# Altium schematic sheet Sheet1.SchDoc (part 2 of 3)
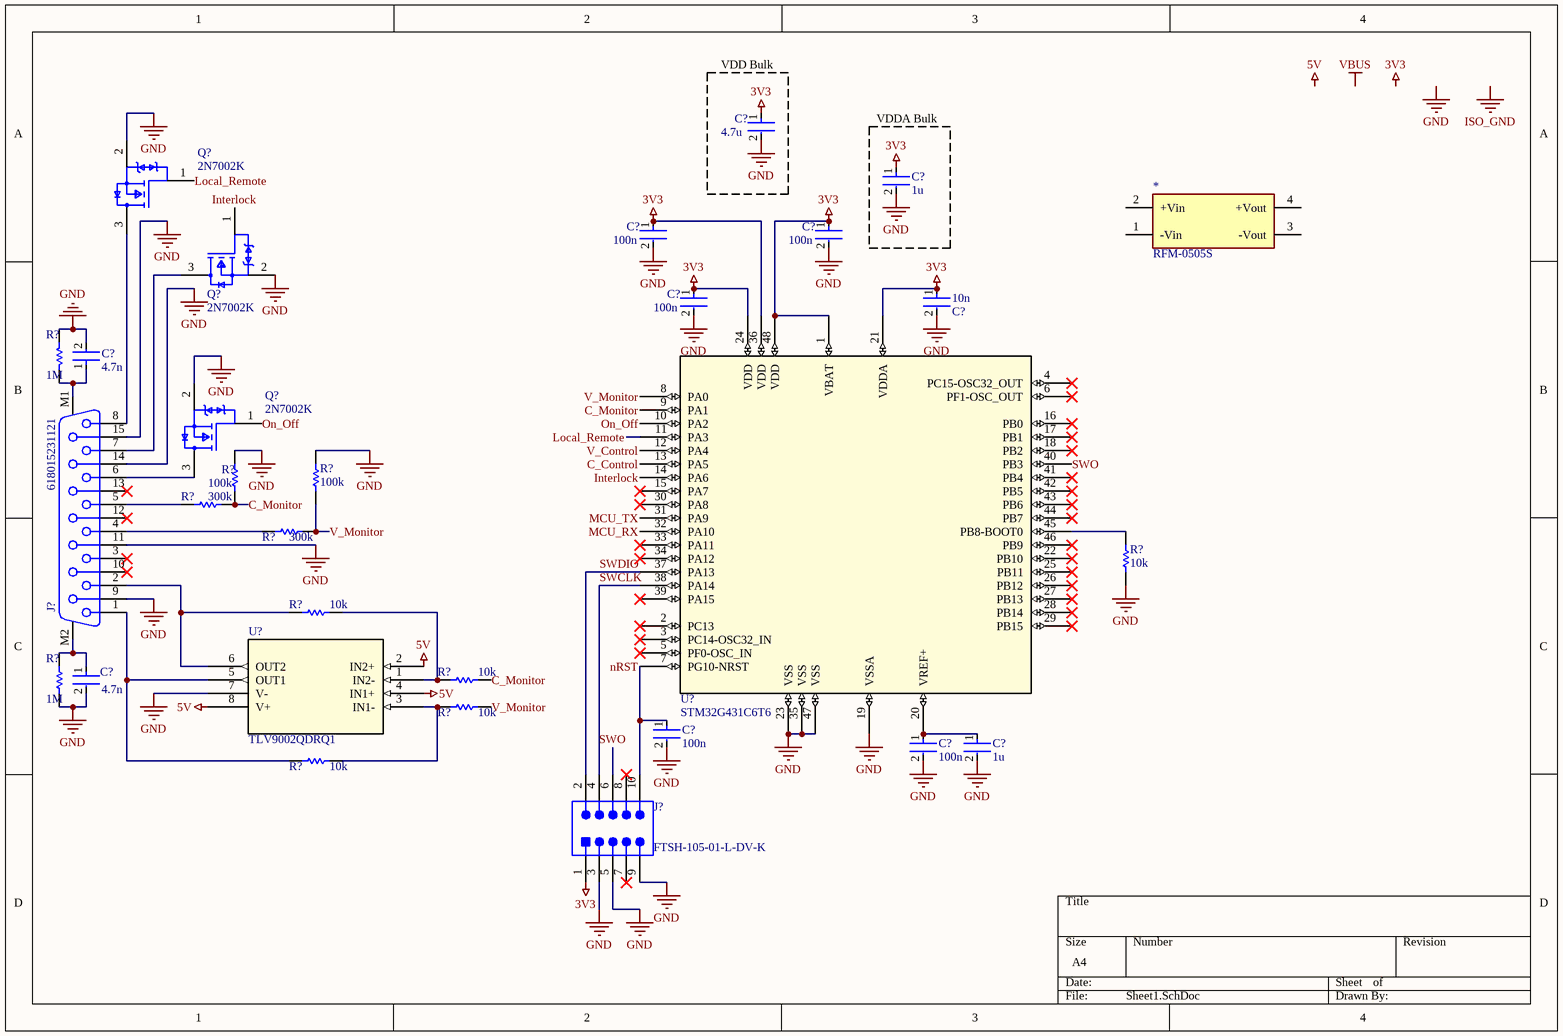
[diagram p1: Sheet1.SchDoc]
## Library data of the parts
10n = CC0603MRX7R9BB103: 50V 10nF X7R ±20% 0603 Multilayer Ceramic Capacitors MLCC - SMD/SMT ROHS; Manufacturer: Yageo Group; Supplier: DigiKey; Supplier Part Number: 311-1826-1-ND; Manufacturer Part Number: CC0603MRX7R9BB103; RoHS: Compliant; Category: Ceramic Capacitors; Stock: 1798; Pricing: 1=0.1, 10=0.032, 50=0.0214, 100=0.0182, 500=0.01294, 1000=0.01133 (USD); Value: 10nF; Case/Package: 0603; Case Code (Imperial): 0603; Case Code (Metric): 1608; China RoHS: Compliant; Composition: Ceramic; Country of Origin: Mainland China, Taiwan; Depth: 800µm; Dielectric: X7R; Dielectric Material: Ceramic; Export Control Classification Number (ECCN) Code: EAR99; Halogen Free: Halogen Free; Height: 800µm; Harmonized Tariff Schedule (HTS) Code: 8532.24.00.20; Introduction Date: 2009-04-17; Lead Free: Lead Free; Length: 1.6mm; Lifecycle Status: Production; Material: Ceramic; Max Operating Temperature: 125°C; Min Operating Temperature: -55°C; Mounting Technology: Surface Mount; Pins: 2; Number of Terminals: 2; Packaging: Tape and Reel; Radiation Hardening: No; REACH SVHC: Yes; Schedule B: 8532240020, 8532240020|8532240020|8532240020|8532240020|8532240020; Termination: SMD/SMT; Thickness: 889µm; Tolerance: 20%; Voltage Rating: 50V; Voltage Rating (DC): 50V; Weight: 2.012816mg; Width: 800µm; ComponentLink1URL: https://datasheet.octopart.com:443/CC0603MRX7R9BB103-Yageo-datasheet-177165144.pdf?src-supplier=IHS; ComponentLink1Description: https://datasheet.octopart.com:443/CC0603MRX7R9BB103-Yageo-datasheet-177165144.pdf?src-supplier=IHS; ComponentLink2URL: https://datasheet.octopart.com:443/CC0603MRX7R9BB103-Yageo-datasheet-82288757.pdf?src-supplier=Upverter; ComponentLink2Description: https://datasheet.octopart.com:443/CC0603MRX7R9BB103-Yageo-datasheet-82288757.pdf?src-supplier=Upverter; ComponentLink3URL: https://datasheet.octopart.com:443/CC0603MRX7R9BB103-Yageo-datasheet-147453679.pdf?src-supplier=Farnell; ComponentLink3Description: https://datasheet.octopart.com:443/CC0603MRX7R9BB103-Yageo-datasheet-147453679.pdf?src-supplier=Farnell; ComponentLink4URL: https://datasheet.octopart.com:443/CC0603MRX7R9BB103-Yageo-datasheet-182029748.pdf?src-supplier=Farnell; ComponentLink4Description: https://datasheet.octopart.com:443/CC0603MRX7R9BB103-Yageo-datasheet-182029748.pdf?src-supplier=Farnell; ComponentLink5URL: https://datasheet.octopart.com:443/CC0603MRX7R9BB103-Yageo-datasheet-182029747.pdf?src-supplier=Farnell; ComponentLink5Description: https://datasheet.octopart.com:443/CC0603MRX7R9BB103-Yageo-datasheet-182029747.pdf?src-supplier=Farnell; ComponentLink6URL: https://datasheet.octopart.com:443/CC0603MRX7R9BB103-Yageo-datasheet-151948686.pdf?src-supplier=Farnell; ComponentLink6Description: https://datasheet.octopart.com:443/CC0603MRX7R9BB103-Yageo-datasheet-151948686.pdf?src-supplier=Farnell; ComponentLink7URL: https://datasheet.octopart.com:443/CC0603MRX7R9BB103-Yageo-datasheet-62336348.pdf?src-supplier=element14+APAC; ComponentLink7Description: https://datasheet.octopart.com:443/CC0603MRX7R9BB103-Yageo-datasheet-62336348.pdf?src-supplier=element14+APAC; ComponentLink8URL: https://datasheet.octopart.com/CC0603MRX7R9BB103-Yageo-datasheet-10883670.pdf; ComponentLink8Description: https://datasheet.octopart.com/CC0603MRX7R9BB103-Yageo-datasheet-10883670.pdf; ComponentLink9URL: https://datasheet.octopart.com:443/CC0603MRX7R9BB103-Yageo-datasheet-166511530.pdf?src-supplier=Future+Electronics; ComponentLink9Description: https://datasheet.octopart.com:443/CC0603MRX7R9BB103-Yageo-datasheet-166511530.pdf?src-supplier=Future+Electronics; ComponentLink10URL: https://datasheet.octopart.com:443/CC0603MRX7R9BB103-Yageo-datasheet-137700082.pdf?src-supplier=Future+Electronics; ComponentLink10Description: https://datasheet.octopart.com:443/CC0603MRX7R9BB103-Yageo-datasheet-137700082.pdf?src-supplier=Future+Electronics; ComponentLink11URL: https://datasheet.octopart.com:443/CC0603MRX7R9BB103-Yageo-datasheet-27626582.pdf?src-supplier=Future+Electronics; ComponentLink11Description: https://datasheet.octopart.com:443/CC0603MRX7R9BB103-Yageo-datasheet-27626582.pdf?src-supplier=Future+Electronics; ComponentLink12URL: https://datasheet.octopart.com:443/CC0603MRX7R9BB103-Yageo-datasheet-15895757.pdf?src-supplier=Future+Electronics; ComponentLink12Description: https://datasheet.octopart.com:443/CC0603MRX7R9BB103-Yageo-datasheet-15895757.pdf?src-supplier=Future+Electronics; ComponentLink13URL: https://datasheet.octopart.com:443/CC0603MRX7R9BB103-Yageo-datasheet-12526321.pdf?src-supplier=Future+Electronics; ComponentLink13Description: https://datasheet.octopart.com:443/CC0603MRX7R9BB103-Yageo-datasheet-12526321.pdf?src-supplier=Future+Electronics; ComponentLink14URL: https://datasheet.octopart.com:443/CC0603MRX7R9BB103-Yageo-datasheet-10882999.pdf?src-supplier=Future+Electronics; ComponentLink14Description: https://datasheet.octopart.com:443/CC0603MRX7R9BB103-Yageo-datasheet-10882999.pdf?src-supplier=Future+Electronics; ComponentLink15URL: https://datasheet.octopart.com:443/CC0603MRX7R9BB103-Yageo-Group-datasheet-165992755.pdf?src-supplier=ODG+(Origin+Data+Global); ComponentLink15Description: https://datasheet.octopart.com:443/CC0603MRX7R9BB103-Yageo-Group-datasheet-165992755.pdf?src-supplier=ODG+(Origin+Data+Global); ComponentLink16URL: http://sigma.octopart.com:80/conflict_mineral_statement/Yageo-company-3.pdf?src-supplier=Compliance+Statements; ComponentLink16Description: http://sigma.octopart.com:80/conflict_mineral_statement/Yageo-company-3.pdf?src-supplier=Compliance+Statements; ComponentLink17URL: http://sigma.octopart.com:80/rohs_statement/Yageo-company-2.pdf?src-supplier=Compliance+Statements; ComponentLink17Description: http://sigma.octopart.com:80/rohs_statement/Yageo-company-2.pdf?src-supplier=Compliance+Statements; Supplier 1: DigiKey; Supplier Part Number 1: 311-1826-1-ND
* = RFM-0505S: DC DC CONVERTER 5V 1W / Isolated Module DC DC Converter 1 Output 5V 200mA - 5V Input; Manufacturer: Recom Power; Max Supply Voltage: 5.5V; Max Output Voltage: 5.25V; Min Input Voltage: 4.5V; Min Output Voltage: 4.75V; Nominal Supply Current: 25mA; Number of Circuits: 1; Switching Frequency: 80kHz; Supplier: DigiKey; Supplier Part Number: 945-3159-ND; Manufacturer Part Number: RFM-0505S; RoHS: Compliant; Category: Voltage Regulators - Switching; Stock: 10396; Pricing: 1=1.96, 5=1.892, 10=1.861, 25=1.8212, 50=1.7918, 100=1.7628, 250=1.72512, 500=1.69706 (USD); Case/Package: SMA; Composition: Hybrid; Height: 10mm; Height - Seated (Max): 10.5mm; Length: 11.5mm; Lifecycle Status: Production; Max Operating Temperature: 85°C; Max Output Power: 1W; Max Power Dissipation: 1W; Min Operating Temperature: -40°C; Min Supply Voltage: 4.5V; Nominal Supply Voltage: 5V; Nominal Output Voltage: 5V; Number of Outputs: 1; Number of Terminals: 4; Output Current: 200mA; Output Power: 1W; Output Voltage: 5V; REACH SVHC: Yes; Schedule B: 8504409580, 8504409580|8504409580|8504409580|8504409580|8504409580; Temperature Grade: Industrial; Terminal Pitch: 2.54mm; Weight: 1.4g; Width: 6mm; ComponentLink1URL: https://datasheet.octopart.com:443/RFM-0505S-Recom-Power-datasheet-133924900.pdf?src-supplier=Farnell; ComponentLink1Description: https://datasheet.octopart.com:443/RFM-0505S-Recom-Power-datasheet-133924900.pdf?src-supplier=Farnell; ComponentLink2URL: https://datasheet.octopart.com:443/RFM-0505S-Recom-Power-datasheet-104425650.pdf?src-supplier=element14+APAC; ComponentLink2Description: https://datasheet.octopart.com:443/RFM-0505S-Recom-Power-datasheet-104425650.pdf?src-supplier=element14+APAC; Supplier 1: Future Electronics; Supplier Part Number 1: RFM-0505S
C?#1 = CC0805KKX5R5BB475: Surface Mount Ceramic Multilayer Capacitor 4.7uF 10% X5R 6.3V 0805 Blister T/R; Manufacturer: Yageo Group; Manufacturer Package Identifier: CC0805-0.85; Value: 4.7µF; Supplier: DigiKey; Supplier Part Number: 311-1861-1-ND; Manufacturer Part Number: CC0805KKX5R5BB475; RoHS: Compliant; Category: Ceramic Capacitors; Stock: 20325; Pricing: 1=0.2, 10=0.112, 50=0.0796, 100=0.0696, 500=0.05296, 1000=0.04784 (USD); Case/Package: 0805; Case Code (Imperial): 0805; Case Code (Metric): 2012; China RoHS: Compliant; Composition: Ceramic; Country of Origin: Mainland China, Taiwan; Depth: 1.25mm; Dielectric: X5R; Dielectric Material: Ceramic; Export Control Classification Number (ECCN) Code: EAR99; Halogen Free: Halogen Free; Height: 1.25mm; Harmonized Tariff Schedule (HTS) Code: 8532.24.00.20; Introduction Date: 2006-06-01; Lead Free: Lead Free; Length: 2mm; Lifecycle Status: Production; Material: Ceramic; Max Operating Temperature: 85°C; Min Operating Temperature: -55°C; Mounting Technology: Surface Mount; Pins: 2; Number of Terminals: 2; Packaging: Tape & Reel (TR); Radiation Hardening: No; REACH SVHC: Yes; Schedule B: 8532240020, 8532240020|8532240020|8532240020|8532240020|8532240020; Termination: SMD/SMT; Thickness: 1.4478mm; Tolerance: 10%; Voltage Rating: 6.3V; Voltage Rating (DC): 6.3V; Weight: 5.499807mg; Width: 1.25mm; ComponentLink1URL: https://datasheet.octopart.com:443/CC0805KKX5R5BB475-Yageo-datasheet-170350636.pdf?src-supplier=IHS; ComponentLink1Description: https://datasheet.octopart.com:443/CC0805KKX5R5BB475-Yageo-datasheet-170350636.pdf?src-supplier=IHS; ComponentLink2URL: https://datasheet.octopart.com:443/CC0805KKX5R5BB475-Yageo-datasheet-78855689.pdf?src-supplier=Upverter; ComponentLink2Description: https://datasheet.octopart.com:443/CC0805KKX5R5BB475-Yageo-datasheet-78855689.pdf?src-supplier=Upverter; ComponentLink3URL: https://datasheet.octopart.com:443/CC0805KKX5R5BB475-Yageo-datasheet-140260304.pdf?src-supplier=element14+APAC; ComponentLink3Description: https://datasheet.octopart.com:443/CC0805KKX5R5BB475-Yageo-datasheet-140260304.pdf?src-supplier=element14+APAC; ComponentLink4URL: https://datasheet.octopart.com:443/CC0805KKX5R5BB475-Yageo-datasheet-182029903.pdf?src-supplier=Farnell; ComponentLink4Description: https://datasheet.octopart.com:443/CC0805KKX5R5BB475-Yageo-datasheet-182029903.pdf?src-supplier=Farnell; ComponentLink5URL: https://datasheet.octopart.com/CC0805KKX5R5BB475-Yageo-datasheet-86397281.pdf; ComponentLink5Description: https://datasheet.octopart.com/CC0805KKX5R5BB475-Yageo-datasheet-86397281.pdf; ComponentLink6URL: https://datasheet.octopart.com:443/CC0805KKX5R5BB475-Yageo-datasheet-8324442.pdf?src-supplier=Newark; ComponentLink6Description: https://datasheet.octopart.com:443/CC0805KKX5R5BB475-Yageo-datasheet-8324442.pdf?src-supplier=Newark; ComponentLink7URL: https://datasheet.octopart.com:443/CC0805KKX5R5BB475-Yageo-datasheet-158238148.pdf?src-supplier=Newark; ComponentLink7Description: https://datasheet.octopart.com:443/CC0805KKX5R5BB475-Yageo-datasheet-158238148.pdf?src-supplier=Newark; ComponentLink8URL: https://datasheet.octopart.com:443/CC0805KKX5R5BB475-Yageo-datasheet-62067349.pdf?src-supplier=Newark; ComponentLink8Description: https://datasheet.octopart.com:443/CC0805KKX5R5BB475-Yageo-datasheet-62067349.pdf?src-supplier=Newark; ComponentLink9URL: https://datasheet.octopart.com:443/CC0805KKX5R5BB475-Yageo-Group-datasheet-184398209.pdf?src-supplier=LCSC; ComponentLink9Description: https://datasheet.octopart.com:443/CC0805KKX5R5BB475-Yageo-Group-datasheet-184398209.pdf?src-supplier=LCSC; ComponentLink10URL: https://datasheet.octopart.com:443/CC0805KKX5R5BB475-Yageo-datasheet-149070021.pdf?src-supplier=TME; ComponentLink10Description: https://datasheet.octopart.com:443/CC0805KKX5R5BB475-Yageo-datasheet-149070021.pdf?src-supplier=TME; ComponentLink11URL: https://datasheet.octopart.com:443/CC0805KKX5R5BB475-Yageo-Group-datasheet-145016144.pdf?src-supplier=ODG+(Origin+Data+Global); ComponentLink11Description: https://datasheet.octopart.com:443/CC0805KKX5R5BB475-Yageo-Group-datasheet-145016144.pdf?src-supplier=ODG+(Origin+Data+Global); ComponentLink12URL: https://datasheet.octopart.com:443/CC0805KKX5R5BB475-Yageo-datasheet-137875056.pdf?src-supplier=Future+Electronics; ComponentLink12Description: https://datasheet.octopart.com:443/CC0805KKX5R5BB475-Yageo-datasheet-137875056.pdf?src-supplier=Future+Electronics; ComponentLink13URL: https://datasheet.octopart.com:443/CC0805KKX5R5BB475-Yageo-datasheet-137700082.pdf?src-supplier=Future+Electronics; ComponentLink13Description: https://datasheet.octopart.com:443/CC0805KKX5R5BB475-Yageo-datasheet-137700082.pdf?src-supplier=Future+Electronics; ComponentLink14URL: https://datasheet.octopart.com:443/CC0805KKX5R5BB475-Yageo-datasheet-137700085.pdf?src-supplier=Future+Electronics; ComponentLink14Description: https://datasheet.octopart.com:443/CC0805KKX5R5BB475-Yageo-datasheet-137700085.pdf?src-supplier=Future+Electronics; ComponentLink15URL: https://datasheet.octopart.com:443/CC0805KKX5R5BB475-Yageo-datasheet-24580494.pdf?src-supplier=Future+Electronics; ComponentLink15Description: https://datasheet.octopart.com:443/CC0805KKX5R5BB475-Yageo-datasheet-24580494.pdf?src-supplier=Future+Electronics; ComponentLink16URL: https://datasheet.octopart.com:443/CC0805KKX5R5BB475-Yageo-datasheet-14389981.pdf?src-supplier=Future+Electronics; ComponentLink16Description: https://datasheet.octopart.com:443/CC0805KKX5R5BB475-Yageo-datasheet-14389981.pdf?src-supplier=Future+Electronics; ComponentLink17URL: https://datasheet.octopart.com:443/CC0805KKX5R5BB475-Yageo-datasheet-10911834.pdf?src-supplier=Future+Electronics; ComponentLink17Description: https://datasheet.octopart.com:443/CC0805KKX5R5BB475-Yageo-datasheet-10911834.pdf?src-supplier=Future+Electronics; ComponentLink18URL: http://sigma.octopart.com:80/conflict_mineral_statement/Yageo-company-3.pdf?src-supplier=Compliance+Statements; ComponentLink18Description: http://sigma.octopart.com:80/conflict_mineral_statement/Yageo-company-3.pdf?src-supplier=Compliance+Statements; ComponentLink19URL: http://sigma.octopart.com:80/rohs_statement/Yageo-company-2.pdf?src-supplier=Compliance+Statements; ComponentLink19Description: http://sigma.octopart.com:80/rohs_statement/Yageo-company-2.pdf?src-supplier=Compliance+Statements; Supplier 1: DigiKey; Supplier Part Number 1: 311-1861-1-ND
C?#2 C?#10 = CC0603MRX5R5BB105: 6.3V 1uF X5R ±20% 0603 Multilayer Ceramic Capacitors MLCC - SMD/SMT ROHS; Manufacturer: Yageo Group; Value: 1µF; Supplier: DigiKey; Supplier Part Number: 311-1813-1-ND; Manufacturer Part Number: CC0603MRX5R5BB105; RoHS: Compliant; Category: Ceramic Capacitors; Stock: 3638; Pricing: 1=0.14, 10=0.078, 50=0.0544, 100=0.0472, 500=0.03518, 1000=0.03148 (USD); Case/Package: 0603; Case Code (Imperial): 0603; Case Code (Metric): 1608; China RoHS: Compliant; Composition: Ceramic; Country of Origin: Mainland China, Taiwan; Depth: 800µm; Dielectric: X5R; Dielectric Material: Ceramic; Export Control Classification Number (ECCN) Code: EAR99; Halogen Free: Halogen Free; Height: 800µm; Harmonized Tariff Schedule (HTS) Code: 8532.24.00.20; Introduction Date: 2009-04-16; Lead Free: Lead Free; Length: 1.6mm; Lifecycle Status: Production; Material: Ceramic; Max Operating Temperature: 85°C; Min Operating Temperature: -55°C; Mounting Technology: Surface Mount; Pins: 2; Number of Terminals: 2; Packaging: Tape & Reel (TR); REACH SVHC: Yes; Schedule B: 8532240020, 8532240020|8532240020|8532240020|8532240020|8532240020; Termination: SMD/SMT; Thickness: 889µm; Tolerance: 20%; Voltage Rating: 6.3V; Voltage Rating (DC): 6.3V; Weight: 2.012816mg; Width: 800µm; ComponentLink1URL: https://datasheet.octopart.com:443/CC0603MRX5R5BB105-Yageo-datasheet-170350636.pdf?src-supplier=IHS; ComponentLink1Description: https://datasheet.octopart.com:443/CC0603MRX5R5BB105-Yageo-datasheet-170350636.pdf?src-supplier=IHS; ComponentLink2URL: https://datasheet.octopart.com:443/CC0603MRX5R5BB105-Yageo-datasheet-82288757.pdf?src-supplier=Upverter; ComponentLink2Description: https://datasheet.octopart.com:443/CC0603MRX5R5BB105-Yageo-datasheet-82288757.pdf?src-supplier=Upverter; ComponentLink3URL: https://datasheet.octopart.com:443/CC0603MRX5R5BB105-Yageo-datasheet-181968798.pdf?src-supplier=Farnell; ComponentLink3Description: https://datasheet.octopart.com:443/CC0603MRX5R5BB105-Yageo-datasheet-181968798.pdf?src-supplier=Farnell; ComponentLink4URL: https://datasheet.octopart.com/CC0603MRX5R5BB105-Yageo-datasheet-86397281.pdf; ComponentLink4Description: https://datasheet.octopart.com/CC0603MRX5R5BB105-Yageo-datasheet-86397281.pdf; ComponentLink5URL: https://datasheet.octopart.com:443/CC0603MRX5R5BB105-Yageo-datasheet-8324442.pdf?src-supplier=Newark; ComponentLink5Description: https://datasheet.octopart.com:443/CC0603MRX5R5BB105-Yageo-datasheet-8324442.pdf?src-supplier=Newark; ComponentLink6URL: https://datasheet.octopart.com:443/CC0603MRX5R5BB105-Yageo-Group-datasheet-184398209.pdf?src-supplier=LCSC; ComponentLink6Description: https://datasheet.octopart.com:443/CC0603MRX5R5BB105-Yageo-Group-datasheet-184398209.pdf?src-supplier=LCSC; ComponentLink7URL: https://datasheet.octopart.com:443/CC0603MRX5R5BB105-Yageo-Group-datasheet-145016144.pdf?src-supplier=ODG+(Origin+Data+Global); ComponentLink7Description: https://datasheet.octopart.com:443/CC0603MRX5R5BB105-Yageo-Group-datasheet-145016144.pdf?src-supplier=ODG+(Origin+Data+Global); ComponentLink8URL: https://datasheet.octopart.com:443/CC0603MRX5R5BB105-Yageo-datasheet-137875056.pdf?src-supplier=Future+Electronics; ComponentLink8Description: https://datasheet.octopart.com:443/CC0603MRX5R5BB105-Yageo-datasheet-137875056.pdf?src-supplier=Future+Electronics; ComponentLink9URL: https://datasheet.octopart.com:443/CC0603MRX5R5BB105-Yageo-datasheet-137700082.pdf?src-supplier=Future+Electronics; ComponentLink9Description: https://datasheet.octopart.com:443/CC0603MRX5R5BB105-Yageo-datasheet-137700082.pdf?src-supplier=Future+Electronics; ComponentLink10URL: https://datasheet.octopart.com:443/CC0603MRX5R5BB105-Yageo-datasheet-137700085.pdf?src-supplier=Future+Electronics; ComponentLink10Description: https://datasheet.octopart.com:443/CC0603MRX5R5BB105-Yageo-datasheet-137700085.pdf?src-supplier=Future+Electronics; ComponentLink11URL: https://datasheet.octopart.com:443/CC0603MRX5R5BB105-Yageo-datasheet-15895757.pdf?src-supplier=Future+Electronics; ComponentLink11Description: https://datasheet.octopart.com:443/CC0603MRX5R5BB105-Yageo-datasheet-15895757.pdf?src-supplier=Future+Electronics; ComponentLink12URL: https://datasheet.octopart.com:443/CC0603MRX5R5BB105-Yageo-datasheet-14389981.pdf?src-supplier=Future+Electronics; ComponentLink12Description: https://datasheet.octopart.com:443/CC0603MRX5R5BB105-Yageo-datasheet-14389981.pdf?src-supplier=Future+Electronics; ComponentLink13URL: https://datasheet.octopart.com:443/CC0603MRX5R5BB105-Yageo-datasheet-10911834.pdf?src-supplier=Future+Electronics; ComponentLink13Description: https://datasheet.octopart.com:443/CC0603MRX5R5BB105-Yageo-datasheet-10911834.pdf?src-supplier=Future+Electronics; ComponentLink14URL: http://sigma.octopart.com:80/conflict_mineral_statement/Yageo-company-3.pdf?src-supplier=Compliance+Statements; ComponentLink14Description: http://sigma.octopart.com:80/conflict_mineral_statement/Yageo-company-3.pdf?src-supplier=Compliance+Statements; ComponentLink15URL: http://sigma.octopart.com:80/rohs_statement/Yageo-company-2.pdf?src-supplier=Compliance+Statements; ComponentLink15Description: http://sigma.octopart.com:80/rohs_statement/Yageo-company-2.pdf?src-supplier=Compliance+Statements; Supplier 1: DigiKey; Supplier Part Number 1: 311-1813-1-ND
C?#3-C?#5 C?#8 C?#9 = CC0603KRX7R9BB104: Multilayer Ceramic Capacitor, CC Series, 0.1 - F, - 10%, X7R, 50 V, 0603 [1608 Metric]; Manufacturer: Yageo Group; Value: 100nF; Voltage: 50V; Supplier: DigiKey; Supplier Part Number: 311-1344-1-ND; Manufacturer Part Number: CC0603KRX7R9BB104; RoHS: Compliant; Category: Ceramic Capacitors; Stock: 3228292; Pricing: 1=0.1, 10=0.043, 50=0.0292, 100=0.0251, 500=0.01812, 1000=0.01598 (USD); Case/Package: 0603; Case Code (Imperial): 0603; Case Code (Metric): 1608; China RoHS: Compliant; Country of Origin: Mainland China, Taiwan; Depth: 800µm; Dielectric: X7R; Dielectric Material: Ceramic; Export Control Classification Number (ECCN) Code: EAR99; Halogen Free: Halogen Free; Height: 800µm; Harmonized Tariff Schedule (HTS) Code: 8532.24.00.20; Introduction Date: 2005-08-18; Lead Free: Lead Free; Length: 1.6mm; Lifecycle Status: Production; Material: Ceramic; Max Operating Temperature: 125°C; Min Operating Temperature: -55°C; Mounting Technology: Surface Mount; Pins: 2; Number of Terminals: 2; Radiation Hardening: No; REACH SVHC: Yes; Schedule B: 8532240020, 8532240020|8532240020, 8532240020|8532240020|8532240020, 8532240020|8532240020|8532240020|8532240020; Termination: SMD/SMT; Thickness: 889µm; Tolerance: 10%; Voltage Rating: 50V; Voltage Rating (DC): 50V; Width: 800µm; ComponentLink1URL: https://datasheet.octopart.com:443/CC0603KRX7R9BB104-Yageo-datasheet-177165144.pdf?src-supplier=IHS; ComponentLink1Description: https://datasheet.octopart.com:443/CC0603KRX7R9BB104-Yageo-datasheet-177165144.pdf?src-supplier=IHS; ComponentLink2URL: https://datasheet.octopart.com:443/CC0603KRX7R9BB104-Yageo-datasheet-82288757.pdf?src-supplier=Upverter; ComponentLink2Description: https://datasheet.octopart.com:443/CC0603KRX7R9BB104-Yageo-datasheet-82288757.pdf?src-supplier=Upverter; ComponentLink3URL: https://datasheet.octopart.com:443/CC0603KRX7R9BB104-Yageo-datasheet-68298032.pdf?src-supplier=Upverter; ComponentLink3Description: https://datasheet.octopart.com:443/CC0603KRX7R9BB104-Yageo-datasheet-68298032.pdf?src-supplier=Upverter; ComponentLink4URL: https://datasheet.octopart.com:443/CC0603KRX7R9BB104-Yageo-Group-datasheet-189192896.pdf?src-supplier=Future+Electronics; ComponentLink4Description: https://datasheet.octopart.com:443/CC0603KRX7R9BB104-Yageo-Group-datasheet-189192896.pdf?src-supplier=Future+Electronics; ComponentLink5URL: https://datasheet.octopart.com:443/CC0603KRX7R9BB104-Yageo-datasheet-12526321.pdf?src-supplier=Future+Electronics; ComponentLink5Description: https://datasheet.octopart.com:443/CC0603KRX7R9BB104-Yageo-datasheet-12526321.pdf?src-supplier=Future+Electronics; ComponentLink6URL: https://datasheet.octopart.com:443/CC0603KRX7R9BB104-Yageo-datasheet-166511530.pdf?src-supplier=Future+Electronics; ComponentLink6Description: https://datasheet.octopart.com:443/CC0603KRX7R9BB104-Yageo-datasheet-166511530.pdf?src-supplier=Future+Electronics; ComponentLink7URL: https://datasheet.octopart.com:443/CC0603KRX7R9BB104-Yageo-datasheet-137700082.pdf?src-supplier=Future+Electronics; ComponentLink7Description: https://datasheet.octopart.com:443/CC0603KRX7R9BB104-Yageo-datasheet-137700082.pdf?src-supplier=Future+Electronics; ComponentLink8URL: https://datasheet.octopart.com:443/CC0603KRX7R9BB104-Yageo-datasheet-137700084.pdf?src-supplier=Future+Electronics; ComponentLink8Description: https://datasheet.octopart.com:443/CC0603KRX7R9BB104-Yageo-datasheet-137700084.pdf?src-supplier=Future+Electronics; ComponentLink9URL: https://datasheet.octopart.com:443/CC0603KRX7R9BB104-Yageo-datasheet-27626582.pdf?src-supplier=Future+Electronics; ComponentLink9Description: https://datasheet.octopart.com:443/CC0603KRX7R9BB104-Yageo-datasheet-27626582.pdf?src-supplier=Future+Electronics; ComponentLink10URL: https://datasheet.octopart.com:443/CC0603KRX7R9BB104-Yageo-datasheet-15895757.pdf?src-supplier=Future+Electronics; ComponentLink10Description: https://datasheet.octopart.com:443/CC0603KRX7R9BB104-Yageo-datasheet-15895757.pdf?src-supplier=Future+Electronics; ComponentLink11URL: https://datasheet.octopart.com:443/CC0603KRX7R9BB104-Yageo-datasheet-8324192.pdf?src-supplier=Future+Electronics; ComponentLink11Description: https://datasheet.octopart.com:443/CC0603KRX7R9BB104-Yageo-datasheet-8324192.pdf?src-supplier=Future+Electronics; ComponentLink12URL: https://datasheet.octopart.com/CC0603KRX7R9BB104-Yageo-datasheet-10883670.pdf; ComponentLink12Description: https://datasheet.octopart.com/CC0603KRX7R9BB104-Yageo-datasheet-10883670.pdf; ComponentLink13URL: https://datasheet.octopart.com:443/CC0603KRX7R9BB104-Yageo-datasheet-181968726.pdf?src-supplier=Newark; ComponentLink13Description: https://datasheet.octopart.com:443/CC0603KRX7R9BB104-Yageo-datasheet-181968726.pdf?src-supplier=Newark; ComponentLink14URL: https://datasheet.octopart.com:443/CC0603KRX7R9BB104-Yageo-datasheet-499490.pdf?src-supplier=Newark; ComponentLink14Description: https://datasheet.octopart.com:443/CC0603KRX7R9BB104-Yageo-datasheet-499490.pdf?src-supplier=Newark; ComponentLink15URL: https://datasheet.octopart.com:443/CC0603KRX7R9BB104-Yageo-datasheet-62336348.pdf?src-supplier=Newark; ComponentLink15Description: https://datasheet.octopart.com:443/CC0603KRX7R9BB104-Yageo-datasheet-62336348.pdf?src-supplier=Newark; ComponentLink16URL: https://datasheet.octopart.com:443/CC0603KRX7R9BB104-Yageo-datasheet-147453679.pdf?src-supplier=Newark; ComponentLink16Description: https://datasheet.octopart.com:443/CC0603KRX7R9BB104-Yageo-datasheet-147453679.pdf?src-supplier=Newark; ComponentLink17URL: https://datasheet.octopart.com:443/CC0603KRX7R9BB104-Yageo-datasheet-151948686.pdf?src-supplier=Farnell; ComponentLink17Description: https://datasheet.octopart.com:443/CC0603KRX7R9BB104-Yageo-datasheet-151948686.pdf?src-supplier=Farnell; ComponentLink18URL: https://datasheet.octopart.com:443/CC0603KRX7R9BB104-Yageo-datasheet-500777.pdf?src-supplier=Farnell; ComponentLink18Description: https://datasheet.octopart.com:443/CC0603KRX7R9BB104-Yageo-datasheet-500777.pdf?src-supplier=Farnell; ComponentLink19URL: https://datasheet.octopart.com:443/CC0603KRX7R9BB104-Yageo-datasheet-178019014.pdf?src-supplier=Burklin+Elektronik; ComponentLink19Description: https://datasheet.octopart.com:443/CC0603KRX7R9BB104-Yageo-datasheet-178019014.pdf?src-supplier=Burklin+Elektronik; ComponentLink20URL: https://datasheet.octopart.com:443/CC0603KRX7R9BB104-Yageo-Group-datasheet-165992755.pdf?src-supplier=ODG+(Origin+Data+Global); ComponentLink20Description: https://datasheet.octopart.com:443/CC0603KRX7R9BB104-Yageo-Group-datasheet-165992755.pdf?src-supplier=ODG+(Origin+Data+Global); ComponentLink21URL: https://datasheet.octopart.com:443/CC0603KRX7R9BB104-Yageo-datasheet-140260305.pdf?src-supplier=SOS+electronic; ComponentLink21Description: https://datasheet.octopart.com:443/CC0603KRX7R9BB104-Yageo-datasheet-140260305.pdf?src-supplier=SOS+electronic; ComponentLink22URL: https://datasheet.octopart.com:443/CC0603KRX7R9BB104-Yageo-datasheet-120101875.pdf?src-supplier=Megastar; ComponentLink22Description: https://datasheet.octopart.com:443/CC0603KRX7R9BB104-Yageo-datasheet-120101875.pdf?src-supplier=Megastar; ComponentLink23URL: https://datasheet.octopart.com:443/CC0603KRX7R9BB104-Yageo-datasheet-8701427.pdf?src-supplier=element14; ComponentLink23Description: https://datasheet.octopart.com:443/CC0603KRX7R9BB104-Yageo-datasheet-8701427.pdf?src-supplier=element14; ComponentLink24URL: https://datasheet.octopart.com:443/CC0603KRX7R9BB104-Yageo-datasheet-5301394.pdf?src-supplier=element14; ComponentLink24Description: https://datasheet.octopart.com:443/CC0603KRX7R9BB104-Yageo-datasheet-5301394.pdf?src-supplier=element14; ComponentLink25URL: https://datasheet.octopart.com:443/CC0603KRX7R9BB104-Yageo-datasheet-17600895.pdf?src-supplier=TME; ComponentLink25Description: https://datasheet.octopart.com:443/CC0603KRX7R9BB104-Yageo-datasheet-17600895.pdf?src-supplier=TME; ComponentLink26URL: http://sigma.octopart.com:80/15889575/rohs_statement/Yageo-CC0603KRX7R9BB104.pdf?src-supplier=Compliance+Statements; ComponentLink26Description: http://sigma.octopart.com:80/15889575/rohs_statement/Yageo-CC0603KRX7R9BB104.pdf?src-supplier=Compliance+Statements; ComponentLink27URL: http://sigma.octopart.com:80/conflict_mineral_statement/Yageo-company-3.pdf?src-supplier=Compliance+Statements; ComponentLink27Description: http://sigma.octopart.com:80/conflict_mineral_statement/Yageo-company-3.pdf?src-supplier=Compliance+Statements; Supplier 1: DigiKey; Supplier Part Number 1: 311-1344-1-ND
C?#6 C?#7 = C0805C472KDRACAUTO: Cap Ceramic 0.0047uF 1000V X7R 10% Pad SMD 0805 125C Automotive AEC-Q200 Medical T/R; Manufacturer: Yageo Group; Value: 4.7nF; Voltage Rating (DC): 1kV; Supplier: DigiKey; Supplier Part Number: 399-16659-1-ND; Manufacturer Part Number: C0805C472KDRACAUTO; RoHS: Compliant; Category: Ceramic Capacitors; Stock: 30147; Pricing: 1=0.28, 10=0.165, 50=0.1198, 100=0.1059, 500=0.08234, 1000=0.07509 (USD); Case/Package: 0805; China RoHS: Compliant; Country of Origin: Mexico; Dielectric: X7R; Dielectric Material: Ceramic; Export Control Classification Number (ECCN) Code: EAR99; Height: 1.25mm; Harmonized Tariff Schedule (HTS) Code: 8532.24.00.20; Introduction Date: 2012-11-28; Length: 2mm; Lifecycle Status: Production; Max Operating Temperature: 125°C; Min Operating Temperature: -55°C; Mounting Technology: Surface Mount; Number of Terminals: 2; Ratings: AEC-Q200; REACH SVHC: Yes; Schedule B: 8532240020; Width: 1.25mm; ComponentLink1URL: https://datasheet.octopart.com:443/C0805C472KDRACAUTO-KEMET-datasheet-182037894.pdf?src-supplier=IHS; ComponentLink1Description: https://datasheet.octopart.com:443/C0805C472KDRACAUTO-KEMET-datasheet-182037894.pdf?src-supplier=IHS; ComponentLink2URL: https://datasheet.octopart.com:443/C0805C472KDRACAUTO-KEMET-datasheet-149524367.pdf?src-supplier=Farnell; ComponentLink2Description: https://datasheet.octopart.com:443/C0805C472KDRACAUTO-KEMET-datasheet-149524367.pdf?src-supplier=Farnell; ComponentLink3URL: https://datasheet.octopart.com:443/C0805C472KDRACAUTO-KEMET-datasheet-104412827.pdf?src-supplier=element14+APAC; ComponentLink3Description: https://datasheet.octopart.com:443/C0805C472KDRACAUTO-KEMET-datasheet-104412827.pdf?src-supplier=element14+APAC; ComponentLink4URL: https://datasheet.octopart.com:443/C0805C472KDRACAUTO-KEMET-datasheet-176334439.pdf?src-supplier=Newark; ComponentLink4Description: https://datasheet.octopart.com:443/C0805C472KDRACAUTO-KEMET-datasheet-176334439.pdf?src-supplier=Newark; ComponentLink5URL: https://datasheet.octopart.com/C0805C472KDRACAUTO-KEMET-datasheet-84169754.pdf; ComponentLink5Description: https://datasheet.octopart.com/C0805C472KDRACAUTO-KEMET-datasheet-84169754.pdf; Supplier 1: DigiKey; Supplier Part Number 1: 399-16659-1-ND
J?#1 = 618015231121: 15 Way Right Angle Through Hole Pcb D-sub Connector Socket, 2.77MM, 2.84MM Pitch; Manufacturer: Wurth Elektronik; Manufacturer Lifecycle Status: ACTIVE; Contact Resistance: 30mΩ; Current Rating: 3A; Gender: Female; Insulation Resistance: 5GΩ; Number of Contacts: 15; Operating Supply Voltage: 125V; YEOL: 1 = Estimated lifetime > 10 years; Supplier: DigiKey; Supplier Part Number: 732-618015231121-ND; Manufacturer Part Number: 618015231121; RoHS: Compliant; Category: D-Sub Connectors; Stock: 1853; Pricing: 1=4.07, 10=3.857, 50=3.4296, 100=2.9925, 250=2.565, 500=2.2895 (USD); Contact Plating: Gold; Depth: 18.5mm; Housing Material: Steel; Insulation Material: PBT; Length: 24.8mm; Lifecycle Status: Production; Max Operating Temperature: 105°C; Min Operating Temperature: -55°C; Mounting Technology: Through Hole; Pins: 15; Number of Rows: 2; Orientation: Right Angle; Pitch: 2.77mm; Termination: SMD/SMT; Voltage Rating: 125V; Width: 12.5mm; ComponentLink1URL: https://datasheet.octopart.com:443/618015231121-W%C3%BCrth-Elektronik-datasheet-149524395.pdf?src-supplier=Wurth+Elektronik; ComponentLink1Description: https://datasheet.octopart.com:443/618015231121-W%C3%BCrth-Elektronik-datasheet-149524395.pdf?src-supplier=Wurth+Elektronik; ComponentLink2URL: https://datasheet.octopart.com:443/618015231121-W%C3%BCrth-Elektronik-datasheet-111088018.pdf?src-supplier=Wurth+Elektronik; ComponentLink2Description: https://datasheet.octopart.com:443/618015231121-W%C3%BCrth-Elektronik-datasheet-111088018.pdf?src-supplier=Wurth+Elektronik; ComponentLink3URL: https://datasheet.octopart.com:443/618015231121-W%C3%BCrth-Elektronik-Midcom-datasheet-10410299.pdf?src-supplier=Newark; ComponentLink3Description: https://datasheet.octopart.com:443/618015231121-W%C3%BCrth-Elektronik-Midcom-datasheet-10410299.pdf?src-supplier=Newark; ComponentLink4URL: https://datasheet.octopart.com:443/618015231121-W%C3%BCrth-Elektronik-Midcom-datasheet-10413304.pdf?src-supplier=element14+APAC; ComponentLink4Description: https://datasheet.octopart.com:443/618015231121-W%C3%BCrth-Elektronik-Midcom-datasheet-10413304.pdf?src-supplier=element14+APAC; ComponentLink5URL: https://datasheet.octopart.com:443/618015231121-W%C3%BCrth-Elektronik-Midcom-datasheet-10470155.pdf?src-supplier=element14+APAC; ComponentLink5Description: https://datasheet.octopart.com:443/618015231121-W%C3%BCrth-Elektronik-Midcom-datasheet-10470155.pdf?src-supplier=element14+APAC; ComponentLink6URL: https://datasheet.octopart.com:443/618015231121-W%C3%BCrth-Elektronik-Midcom-datasheet-10489568.pdf?src-supplier=Farnell; ComponentLink6Description: https://datasheet.octopart.com:443/618015231121-W%C3%BCrth-Elektronik-Midcom-datasheet-10489568.pdf?src-supplier=Farnell; Supplier 1: DigiKey; Supplier Part Number 1: 732-618015231121-ND
J?#2 = FTSH-105-01-L-DV-K: CONN HEADER SMD 10POS 1.27MM / Connector Header Surface Mount 10 position 0.050" (1.27mm); Manufacturer: Samtec; Manufacturer Lifecycle Status: PRODUCTION; Connector Type: Male Pin; Gender: Female; Max Current Rating: 1.75A; Number of Contacts: 10; Supplier: DigiKey; Supplier Part Number: SAM8799-ND; Manufacturer Part Number: FTSH-105-01-L-DV-K; RoHS: Compliant; Category: Headers and Wire Housings; Stock: 73552; Pricing: 1=1.37, 100=1.075, 250=0.972, 500=0.855, 1000=0.753, 2500=0.68, 5000=0.607, 10000=0.52375 (USD); Color: Black; Contact Material: Bronze; Contact Mating Length: 3.048mm; Contact Plating: Gold; Depth: 3.43mm; Housing Color: Black; Housing Material: Polymer; Lead Free: Lead Free; Length: 6.35mm; Lifecycle Status: Production; Max Operating Temperature: 125°C; Min Operating Temperature: -55°C; Mounting Technology: Surface Mount; Pins: 10; Number of Positions: 10; Number of Rows: 2; Pitch: 1.27mm; Radiation Hardening: No; REACH SVHC: No; Row Spacing: 1.27mm; Termination: Solder; ComponentLink1URL: https://datasheet.octopart.com:443/FTSH-105-01-L-DV-K-Samtec-datasheet-140825048.pdf?src-supplier=Electro+Sonic; ComponentLink1Description: https://datasheet.octopart.com:443/FTSH-105-01-L-DV-K-Samtec-datasheet-140825048.pdf?src-supplier=Electro+Sonic; ComponentLink2URL: https://datasheet.octopart.com:443/FTSH-105-01-L-DV-K-Samtec-datasheet-86818370.pdf?src-supplier=Upverter; ComponentLink2Description: https://datasheet.octopart.com:443/FTSH-105-01-L-DV-K-Samtec-datasheet-86818370.pdf?src-supplier=Upverter; ComponentLink3URL: https://datasheet.octopart.com:443/FTSH-105-01-L-DV-K-Samtec-datasheet-97029545.pdf?src-supplier=Newark; ComponentLink3Description: https://datasheet.octopart.com:443/FTSH-105-01-L-DV-K-Samtec-datasheet-97029545.pdf?src-supplier=Newark; ComponentLink4URL: https://datasheet.octopart.com:443/FTSH-105-01-L-DV-K-Samtec-datasheet-41642889.pdf?src-supplier=Newark; ComponentLink4Description: https://datasheet.octopart.com:443/FTSH-105-01-L-DV-K-Samtec-datasheet-41642889.pdf?src-supplier=Newark; ComponentLink5URL: https://sigma.octopart.com:443/140871554/technical_drawing/Samtec-FTSH-105-01-L-DV-K.pdf?src-supplier=Samtec; ComponentLink5Description: https://sigma.octopart.com:443/140871554/technical_drawing/Samtec-FTSH-105-01-L-DV-K.pdf?src-supplier=Samtec; ComponentLink6URL: https://sigma.octopart.com:443/97029548/technical_drawing/Samtec-FTSH-105-01-L-DV-K.pdf?src-supplier=Samtec; ComponentLink6Description: https://sigma.octopart.com:443/97029548/technical_drawing/Samtec-FTSH-105-01-L-DV-K.pdf?src-supplier=Samtec; ComponentLink7URL: https://datasheet.octopart.com:443/FTSH-105-01-L-DV-K-Samtec-datasheet-100454331.pdf?src-supplier=Farnell; ComponentLink7Description: https://datasheet.octopart.com:443/FTSH-105-01-L-DV-K-Samtec-datasheet-100454331.pdf?src-supplier=Farnell; ComponentLink8URL: https://datasheet.octopart.com:443/FTSH-105-01-L-DV-K-Samtec-datasheet-33007714.pdf?src-supplier=Farnell; ComponentLink8Description: https://datasheet.octopart.com:443/FTSH-105-01-L-DV-K-Samtec-datasheet-33007714.pdf?src-supplier=Farnell; ComponentLink9URL: https://datasheet.octopart.com:443/FTSH-105-01-L-DV-K-Samtec-datasheet-16646209.pdf?src-supplier=element14+APAC; ComponentLink9Description: https://datasheet.octopart.com:443/FTSH-105-01-L-DV-K-Samtec-datasheet-16646209.pdf?src-supplier=element14+APAC; ComponentLink10URL: https://datasheet.octopart.com:443/FTSH-105-01-L-DV-K-Samtec-datasheet-180249087.pdf?src-supplier=JRH+Electronics; ComponentLink10Description: https://datasheet.octopart.com:443/FTSH-105-01-L-DV-K-Samtec-datasheet-180249087.pdf?src-supplier=JRH+Electronics; ComponentLink11URL: https://datasheet.octopart.com:443/FTSH-105-01-L-DV-K-Samtec-datasheet-176663386.pdf?src-supplier=Toby+Electronics; ComponentLink11Description: https://datasheet.octopart.com:443/FTSH-105-01-L-DV-K-Samtec-datasheet-176663386.pdf?src-supplier=Toby+Electronics; ComponentLink12URL: https://datasheet.octopart.com:443/FTSH-105-01-L-DV-K-Samtec-datasheet-133497664.pdf?src-supplier=Toby+Electronics; ComponentLink12Description: https://datasheet.octopart.com:443/FTSH-105-01-L-DV-K-Samtec-datasheet-133497664.pdf?src-supplier=Toby+Electronics; ComponentLink13URL: https://datasheet.octopart.com:443/FTSH-105-01-L-DV-K-Samtec-datasheet-116535196.pdf?src-supplier=Toby+Electronics; ComponentLink13Description: https://datasheet.octopart.com:443/FTSH-105-01-L-DV-K-Samtec-datasheet-116535196.pdf?src-supplier=Toby+Electronics; ComponentLink14URL: https://datasheet.octopart.com:443/FTSH-105-01-L-DV-K-Samtec-datasheet-151470459.pdf?src-supplier=Sager+Electronics; ComponentLink14Description: https://datasheet.octopart.com:443/FTSH-105-01-L-DV-K-Samtec-datasheet-151470459.pdf?src-supplier=Sager+Electronics; ComponentLink15URL: https://datasheet.octopart.com:443/FTSH-105-01-L-DV-K-Samtec-datasheet-151470458.pdf?src-supplier=Sager+Electronics; ComponentLink15Description: https://datasheet.octopart.com:443/FTSH-105-01-L-DV-K-Samtec-datasheet-151470458.pdf?src-supplier=Sager+Electronics; ComponentLink16URL: https://datasheet.octopart.com:443/FTSH-105-01-L-DV-K-Samtec-datasheet-137316104.pdf?src-supplier=Future+Electronics; ComponentLink16Description: https://datasheet.octopart.com:443/FTSH-105-01-L-DV-K-Samtec-datasheet-137316104.pdf?src-supplier=Future+Electronics; ComponentLink17URL: https://datasheet.octopart.com/FTSH-105-01-L-DV-K-Samtec-datasheet-13696953.pdf; ComponentLink17Description: https://datasheet.octopart.com/FTSH-105-01-L-DV-K-Samtec-datasheet-13696953.pdf; ComponentLink18URL: https://datasheet.octopart.com/FTSH-105-01-L-DV-K-Samtec-datasheet-11553404.pdf; ComponentLink18Description: https://datasheet.octopart.com/FTSH-105-01-L-DV-K-Samtec-datasheet-11553404.pdf; Supplier 1: DigiKey; Supplier Part Number 1: SAM8799-ND
Q?#1-Q?#3 = 2N7002K: Mosfet N-ch 60V 300MA SOT23 / Trans Mosfet N-ch 60V 0.3A 3-PIN SOT-23 T/r; Manufacturer: onsemi; Manufacturer Lifecycle Status: ACTIVE; Continuous Drain Current (ID): 115mA; Current: 3A; Drain to Source Resistance: 2Ω; Element Configuration: Single; Gate to Source Voltage (Vgs): 20V; Input Capacitance: 50pF; Max Junction Temperature (Tj): 150°C; Max Power Dissipation: 350W; Number of Channels: 1; Power Dissipation: 300mW; Value: 2Ω; Threshold Voltage: 2.5V; Turn-Off Delay Time: 55.8ns; Turn-On Delay Time: 12.2ns; Supplier: DigiKey; Supplier Part Number: 2N7002KCT-ND; Manufacturer Part Number: 2N7002K; RoHS: Compliant; Category: MOSFETs; Stock: 393574; Pricing: 1=0.33, 10=0.203, 100=0.1271, 500=0.09384, 1000=0.08309 (USD); Case/Package: SOT-23; China RoHS: Compliant; Contact Plating: Tin; Drain to Source Breakdown Voltage: 60V; Drain to Source Voltage (Vdss): 60V; Height: 1.11mm; Lead Free: Lead Free; Length: 2.92mm; Lifecycle Status: Production; Max Operating Temperature: 150°C; Min Breakdown Voltage: 60V; Min Operating Temperature: -55°C; Mounting Technology: Surface Mount; Number of Elements: 1; Pins: 3; Number of Terminals: 3; Radiation Hardening: No; Rds On Max: 2Ω; REACH SVHC: Yes; Schedule B: 8541210080, 8541210080|8541210080|8541210080|8541210080|8541210080; Voltage: 60V; Width: 1.3mm; ComponentLink1URL: https://datasheet.octopart.com:443/2N7002K-onsemi-datasheet-180957336.pdf?src-supplier=IHS; ComponentLink1Description: https://datasheet.octopart.com:443/2N7002K-onsemi-datasheet-180957336.pdf?src-supplier=IHS; ComponentLink2URL: https://datasheet.octopart.com:443/2N7002K-Fairchild-Semiconductor-datasheet-34208596.pdf?src-supplier=IHS; ComponentLink2Description: https://datasheet.octopart.com:443/2N7002K-Fairchild-Semiconductor-datasheet-34208596.pdf?src-supplier=IHS; ComponentLink3URL: https://datasheet.octopart.com:443/2N7002K-ON-Semiconductor-datasheet-138897972.pdf?src-supplier=onsemi; ComponentLink3Description: https://datasheet.octopart.com:443/2N7002K-ON-Semiconductor-datasheet-138897972.pdf?src-supplier=onsemi; ComponentLink4URL: https://datasheet.octopart.com:443/2N7002K-ON-Semiconductor-datasheet-147841327.pdf?src-supplier=onsemi; ComponentLink4Description: https://datasheet.octopart.com:443/2N7002K-ON-Semiconductor-datasheet-147841327.pdf?src-supplier=onsemi; ComponentLink5URL: https://datasheet.octopart.com:443/2N7002K-ON-Semiconductor-datasheet-81464098.pdf?src-supplier=onsemi; ComponentLink5Description: https://datasheet.octopart.com:443/2N7002K-ON-Semiconductor-datasheet-81464098.pdf?src-supplier=onsemi; ComponentLink6URL: https://datasheet.octopart.com:443/2N7002K-ON-Semiconductor-datasheet-8636720.pdf?src-supplier=onsemi; ComponentLink6Description: https://datasheet.octopart.com:443/2N7002K-ON-Semiconductor-datasheet-8636720.pdf?src-supplier=onsemi; ComponentLink7URL: https://sigma.octopart.com:443/138897241/technical_drawing/ON-Semiconductor-2N7002K.pdf?src-supplier=Upverter; ComponentLink7Description: https://sigma.octopart.com:443/138897241/technical_drawing/ON-Semiconductor-2N7002K.pdf?src-supplier=Upverter; ComponentLink8URL: https://datasheet.octopart.com:443/2N7002K-ON-Semiconductor-datasheet-13704821.pdf?src-supplier=element14+APAC; ComponentLink8Description: https://datasheet.octopart.com:443/2N7002K-ON-Semiconductor-datasheet-13704821.pdf?src-supplier=element14+APAC; ComponentLink9URL: https://datasheet.octopart.com:443/2N7002K-ON-Semiconductor-datasheet-86682065.pdf?src-supplier=element14+APAC; ComponentLink9Description: https://datasheet.octopart.com:443/2N7002K-ON-Semiconductor-datasheet-86682065.pdf?src-supplier=element14+APAC; ComponentLink10URL: https://datasheet.octopart.com:443/2N7002K-onsemi-datasheet-181958640.pdf?src-supplier=Newark; ComponentLink10Description: https://datasheet.octopart.com:443/2N7002K-onsemi-datasheet-181958640.pdf?src-supplier=Newark; ComponentLink11URL: https://datasheet.octopart.com:443/2N7002K-Fairchild-Semiconductor-datasheet-67650041.pdf?src-supplier=Newark; ComponentLink11Description: https://datasheet.octopart.com:443/2N7002K-Fairchild-Semiconductor-datasheet-67650041.pdf?src-supplier=Newark; ComponentLink12URL: https://datasheet.octopart.com:443/2N7002K-Fairchild-Semiconductor-datasheet-68365086.pdf?src-supplier=Newark; ComponentLink12Description: https://datasheet.octopart.com:443/2N7002K-Fairchild-Semiconductor-datasheet-68365086.pdf?src-supplier=Newark; ComponentLink13URL: https://datasheet.octopart.com:443/2N7002K-Fairchild-Semiconductor-datasheet-68558619.pdf?src-supplier=Newark; ComponentLink13Description: https://datasheet.octopart.com:443/2N7002K-Fairchild-Semiconductor-datasheet-68558619.pdf?src-supplier=Newark; ComponentLink14URL: https://datasheet.octopart.com:443/2N7002K-ON-Semiconductor-datasheet-137315652.pdf?src-supplier=Future+Electronics; ComponentLink14Description: https://datasheet.octopart.com:443/2N7002K-ON-Semiconductor-datasheet-137315652.pdf?src-supplier=Future+Electronics; ComponentLink15URL: https://sigma.octopart.com:443/17343971/technical_drawing/Fairchild-Semiconductor-2N7002K.pdf?src-supplier=Fairchild+Semiconductor; ComponentLink15Description: https://sigma.octopart.com:443/17343971/technical_drawing/Fairchild-Semiconductor-2N7002K.pdf?src-supplier=Fairchild+Semiconductor; ComponentLink16URL: https://datasheet.octopart.com:443/2N7002K-Fairchild-Semiconductor-datasheet-67878677.pdf?src-supplier=Farnell; ComponentLink16Description: https://datasheet.octopart.com:443/2N7002K-Fairchild-Semiconductor-datasheet-67878677.pdf?src-supplier=Farnell; ComponentLink17URL: https://datasheet.octopart.com:443/2N7002K-Fairchild-Semiconductor-datasheet-68650436.pdf?src-supplier=Farnell; ComponentLink17Description: https://datasheet.octopart.com:443/2N7002K-Fairchild-Semiconductor-datasheet-68650436.pdf?src-supplier=Farnell; ComponentLink18URL: https://datasheet.octopart.com:443/2N7002K-Fairchild-Semiconductor-datasheet-78857226.pdf?src-supplier=Farnell; ComponentLink18Description: https://datasheet.octopart.com:443/2N7002K-Fairchild-Semiconductor-datasheet-78857226.pdf?src-supplier=Farnell; ComponentLink19URL: http://sigma.octopart.com:80/150600003/rohs_statement/ON-Semiconductor-2N7002K.pdf?src-supplier=Compliance+Statements; ComponentLink19Description: http://sigma.octopart.com:80/150600003/rohs_statement/ON-Semiconductor-2N7002K.pdf?src-supplier=Compliance+Statements; ComponentLink20URL: http://sigma.octopart.com:80/17343977/reach_statement/Fairchild-Semiconductor-2N7002K.pdf?src-supplier=Compliance+Statements; ComponentLink20Description: http://sigma.octopart.com:80/17343977/reach_statement/Fairchild-Semiconductor-2N7002K.pdf?src-supplier=Compliance+Statements; ComponentLink21URL: http://sigma.octopart.com:80/17343978/materials_sheet/Fairchild-Semiconductor-2N7002K.pdf?src-supplier=Compliance+Statements; ComponentLink21Description: http://sigma.octopart.com:80/17343978/materials_sheet/Fairchild-Semiconductor-2N7002K.pdf?src-supplier=Compliance+Statements; ComponentLink22URL: http://sigma.octopart.com:80/33036988/materials_sheet/Fairchild-Semiconductor-2N7002K.pdf?src-supplier=Compliance+Statements; ComponentLink22Description: http://sigma.octopart.com:80/33036988/materials_sheet/Fairchild-Semiconductor-2N7002K.pdf?src-supplier=Compliance+Statements; ComponentLink23URL: http://sigma.octopart.com:80/33036987/reach_statement/Fairchild-Semiconductor-2N7002K.pdf?src-supplier=Compliance+Statements; ComponentLink23Description: http://sigma.octopart.com:80/33036987/reach_statement/Fairchild-Semiconductor-2N7002K.pdf?src-supplier=Compliance+Statements; ComponentLink24URL: http://sigma.octopart.com:80/reach_statement/ON-Semiconductor-company-79.pdf?src-supplier=Compliance+Statements; ComponentLink24Description: http://sigma.octopart.com:80/reach_statement/ON-Semiconductor-company-79.pdf?src-supplier=Compliance+Statements; ComponentLink25URL: http://sigma.octopart.com:80/rohs_statement/Fairchild-Semiconductor-company-11.pdf?src-supplier=Compliance+Statements; ComponentLink25Description: http://sigma.octopart.com:80/rohs_statement/Fairchild-Semiconductor-company-11.pdf?src-supplier=Compliance+Statements; ComponentLink26URL: http://sigma.octopart.com:80/rohs_statement/Fairchild-Semiconductor-company-10.pdf?src-supplier=Compliance+Statements; ComponentLink26Description: http://sigma.octopart.com:80/rohs_statement/Fairchild-Semiconductor-company-10.pdf?src-supplier=Compliance+Statements; ComponentLink27URL: http://sigma.octopart.com:80/reach_statement/Fairchild-Semiconductor-company-9.pdf?src-supplier=Compliance+Statements; ComponentLink27Description: http://sigma.octopart.com:80/reach_statement/Fairchild-Semiconductor-company-9.pdf?src-supplier=Compliance+Statements; ComponentLink28URL: https://octopart.com:443/opatz8j6/c1?t=nm5kdMlbaAnwpklrVZblZ0nE71AQlgwh7ERqQoEJhKvEfgRp_9FXj7IMoPPC8V_j13LWXOpO2Jxw4bOkneI3J4oQ-Ueqca9fxYR6kFJosDJCZUuoEPm8PptoZzKZNXIWwYdL1v0f_3jxmMMd6AmYg9Y7R4OLdY3QL6Rk6u6ai-3ss5V1K0SdYAJs7A9F18xCMj7KK3OJ0kjjq8to-n9XtuWqv7DBv7T5vrdVNUg03mJ5ApziGpyAB5Qe7qbvoVw8pQA7F0WEglJk1PRa4-p6s3a5dQiLDUC_bYLpYK_Y4Yhi_XqAGpD62eBhzZC41UC6OOQBzi0Qvg0NEKn45CaGve0MJuREN5MOXiQU&src-supplier=Compliance+Statements; ComponentLink28Description: https://octopart.com:443/opatz8j6/c1?t=nm5kdMlbaAnwpklrVZblZ0nE71AQlgwh7ERqQoEJhKvEfgRp_9FXj7IMoPPC8V_j13LWXOpO2Jxw4bOkneI3J4oQ-Ueqca9fxYR6kFJosDJCZUuoEPm8PptoZzKZNXIWwYdL1v0f_3jxmMMd6AmYg9Y7R4OLdY3QL6Rk6u6ai-3ss5V1K0SdYAJs7A9F18xCMj7KK3OJ0kjjq8to-n9XtuWqv7DBv7T5vrdVNUg03mJ5ApziGpyAB5Qe7qbvoVw8pQA7F0WEglJk1PRa4-p6s3a5dQiLDUC_bYLpYK_Y4Yhi_XqAGpD62eBhzZC41UC6OOQBzi0Qvg0NEKn45CaGve0MJuREN5MOXiQU&src-supplier=Compliance+Statements; ComponentLink29URL: https://octopart.com:443/opatz8j6/c1?t=yP1dprRIHwIgdvtjb9FYqRaP3_9HWgrBaL9JkhjecsSuf0n6cINMsFwp5N6FMygctrzVDOAIh4pqo1B7NhLuP4EfhfgMmii0srxvh2XxIZc2UWh74_aW-dJirl-sIPHhCpS4y3FsLHcYkfI7uz7Zobk3yF8mMTCkQ2uO5Ev9E03_1hZh6X3YtwOYI82JGjIbo8QvUN_FXJ9Womd2nii1m-sUjS3nWbw_QaYVMn5ZbNRqutWyxY-yUPVqm24VyLJbSNi-am4bjCcC6TDsH0hBYj3fGvqNFGx_58D2X5w3EoEA4KlvTi0mcDs5gj__gSGJCxXMmsSQPns7LYMZtqXHHcrx3ZG_xUyLjZk&src-supplier=Compliance+Statements; ComponentLink29Description: https://octopart.com:443/opatz8j6/c1?t=yP1dprRIHwIgdvtjb9FYqRaP3_9HWgrBaL9JkhjecsSuf0n6cINMsFwp5N6FMygctrzVDOAIh4pqo1B7NhLuP4EfhfgMmii0srxvh2XxIZc2UWh74_aW-dJirl-sIPHhCpS4y3FsLHcYkfI7uz7Zobk3yF8mMTCkQ2uO5Ev9E03_1hZh6X3YtwOYI82JGjIbo8QvUN_FXJ9Womd2nii1m-sUjS3nWbw_QaYVMn5ZbNRqutWyxY-yUPVqm24VyLJbSNi-am4bjCcC6TDsH0hBYj3fGvqNFGx_58D2X5w3EoEA4KlvTi0mcDs5gj__gSGJCxXMmsSQPns7LYMZtqXHHcrx3ZG_xUyLjZk&src-supplier=Compliance+Statements; Supplier 1: DigiKey; Supplier Part Number 1: 2N7002KCT-ND